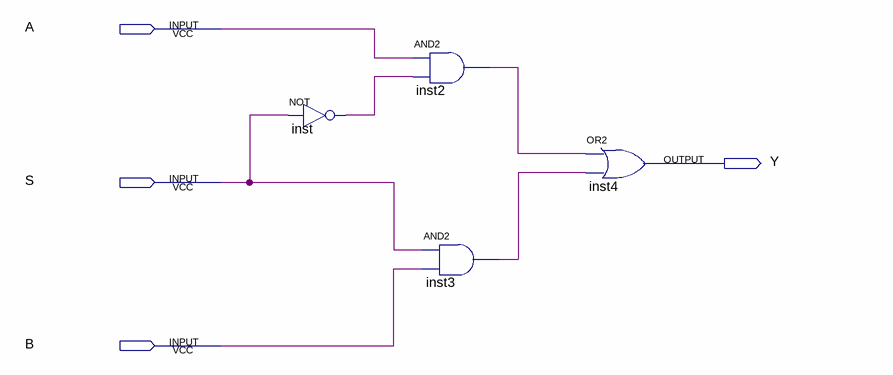
[diagram p0: schematic sheet]
// Quartus schematic multiplexer.bdf as structural Verilog: 4 symbols, 4 pins
module multiplexer (
  input  A,
  input  S,
  input  B,
  output Y
);

  wire inst2_out, inst3_out, inst_out;

  not inst (inst_out, S);
  and inst2 (inst2_out, A, inst_out);
  and inst3 (inst3_out, S, B);
  or inst4 (Y, inst2_out, inst3_out);
endmodule
